# EAGLE design FluxR3-v3 (EAGLE 7.2.0)
ABBREV: Flux3; AUTHOR: Nadya B.; PROJECT: Fluxamasynth 3
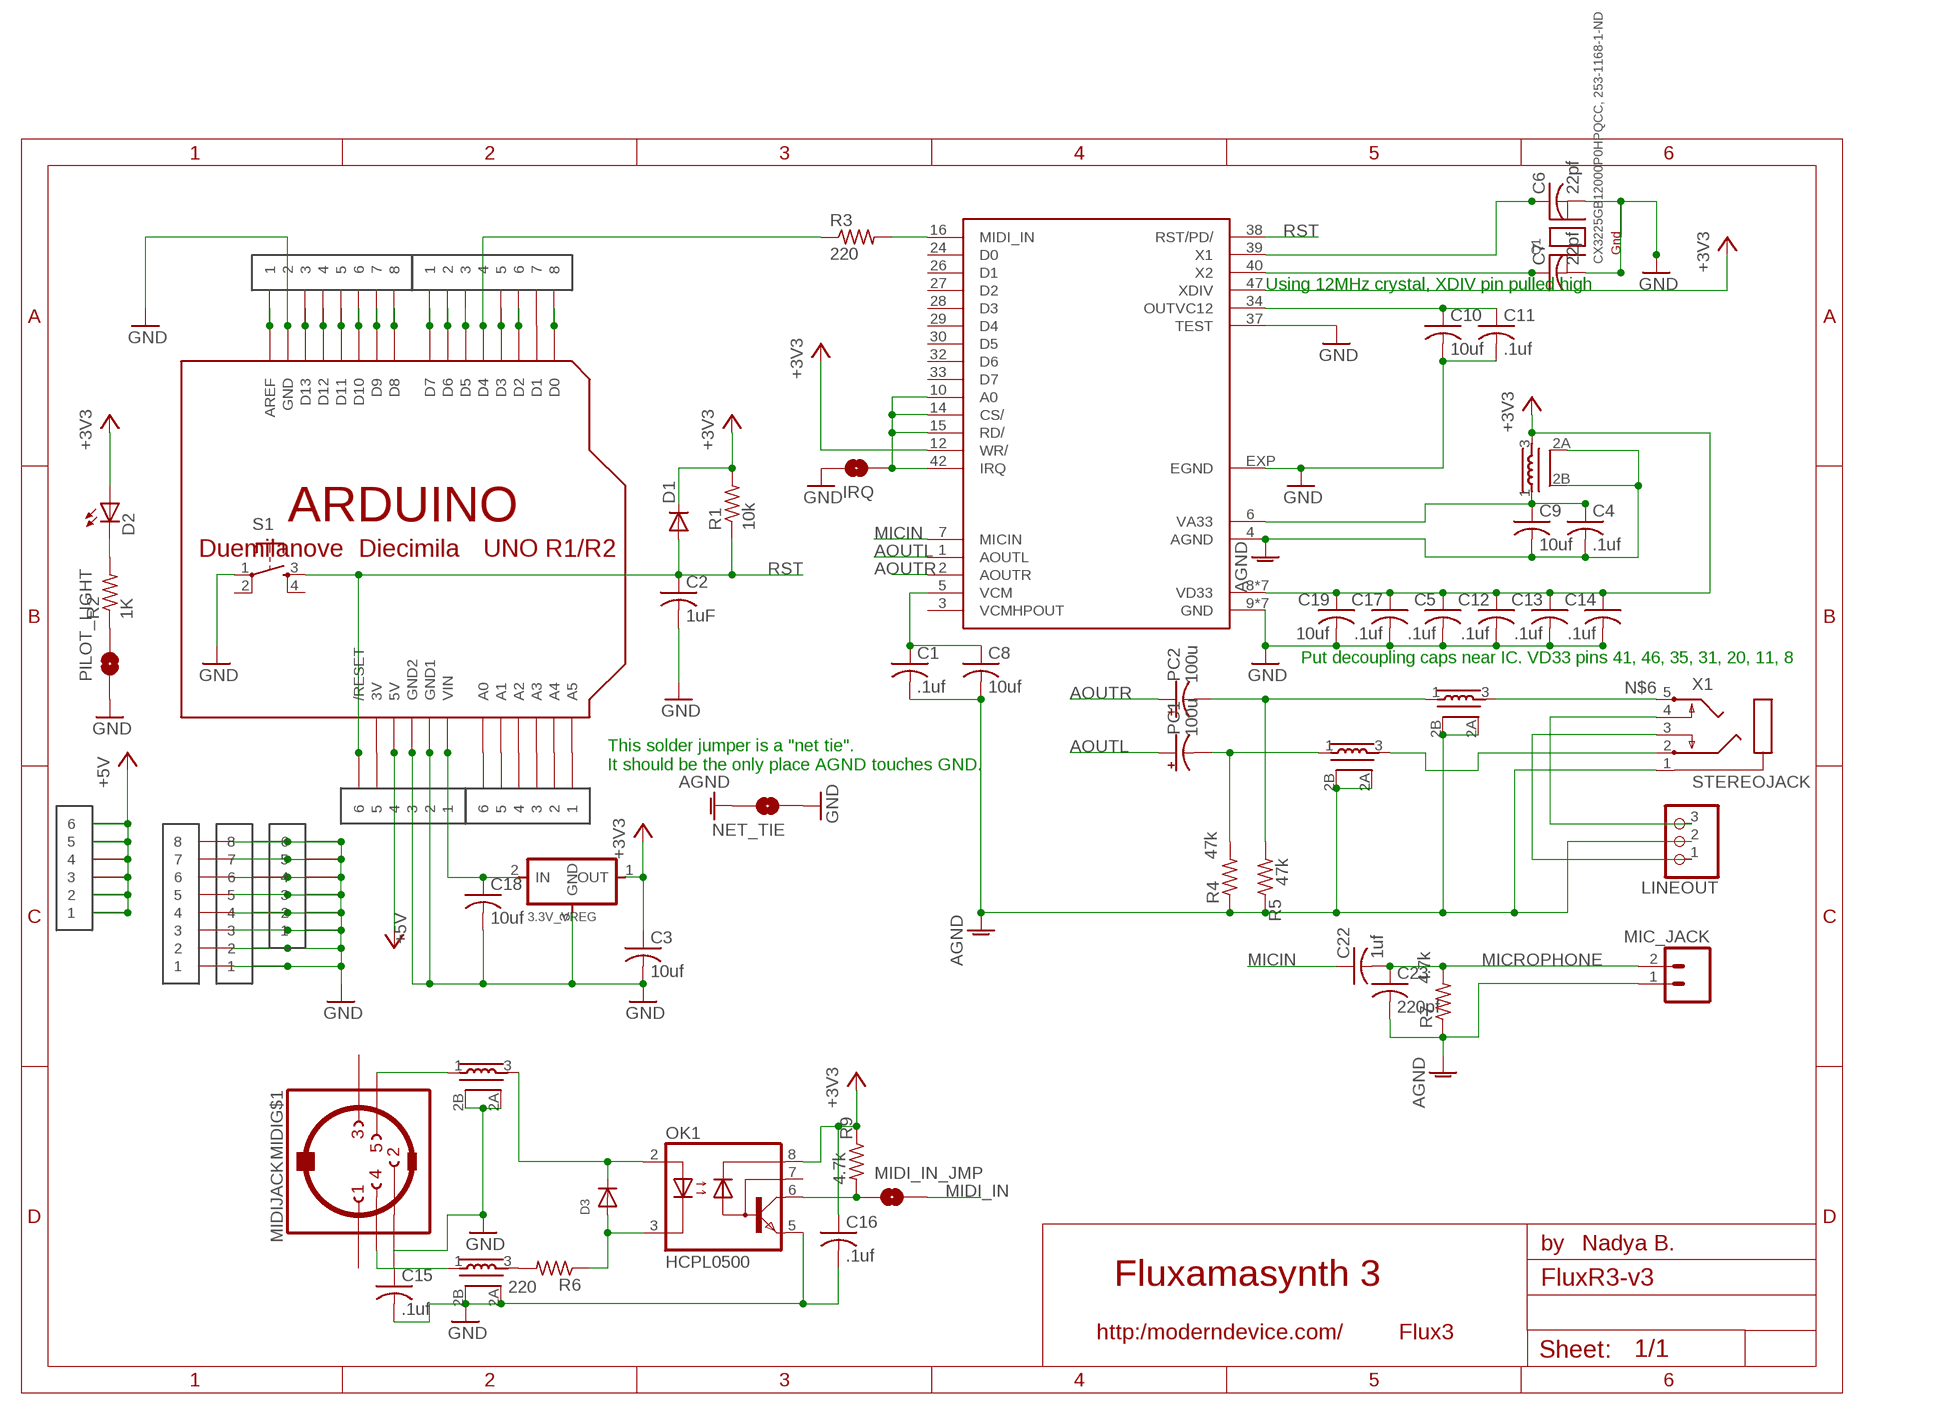
[diagram p0: schematic, sheet 1]

## Parts
3.3V_VREG  REGULATORSOT23  [SOT23]
ARDUINO  ARDUINO-NOHOLE  [ARDUINO-NOHOLE]
C1  .1uf  C-USC0603K  [C0603K]
C2  1uF  C-USC0805  [C0805]
C3  10uf  C-USC0805  [C0805]
C4  .1uf  C-USC0603K  [C0603K]
C5  .1uf  C-USC0603K  [C0603K]
C6  22pf  C-USC0805  [C0805]
C7  22pf  C-USC0805  [C0805]
C8  10uf  C-USC0805  [C0805]
C9  10uf  C-USC0805  [C0805]
C10  10uf  C-USC0805  [C0805]
C11  .1uf  C-USC0603K  [C0603K]
C12  .1uf  C-USC0603K  [C0603K]
C13  .1uf  C-USC0603K  [C0603K]
C14  .1uf  C-USC0603K  [C0603K]
C15  .1uf  C-USC0805  [C0805]
C16  .1uf  C-USC0805  [C0805]
C17  .1uf  C-USC0603K  [C0603K]
C18  10uf  C-USC0805  [C0805]
C19  10uf  C-USC0805  [C0805]
C22  1uf  C-USC0805  [C0805]
C23  220pf  C-USC0805  [C0805]
D1  DIODESOD123  [SOD123]
D2  LED1206  [LED-1206]
D3  DIODE_SOD-523  [SOD-523]
IRQ  MODERNDEVICE_SOLDERJUMPERTRACE  [MODERNDEVICE_SJ_2S-TRACE]
LINEOUT  PINHD-1X3  [1X03]
MIC_JACK  M02PTH  [1X02]
MIDI  MIDIJACK  [CP-2350]
MIDI_IN_JMP  SOLDERJUMPERNO  [SJ_2S-NO]
NET_TIE  MODERNDEVICE_SOLDERJUMPERTRACE  [MODERNDEVICE_SJ_2S-TRACE]
OK1  HCPL0500  [SOIC08]
PC1  100u  CPOL-USE  [PANASONIC_E]
PC2  100u  CPOL-USE  [PANASONIC_E]
PILOT_LIGHT  MODERNDEVICE_SOLDERJUMPERTRACE  [MODERNDEVICE_SJ_2S-TRACE]
Q1  CX3225GB12000P0HPQCC, 253-1168-1-ND  MODERNDEVICE_XTAL-4-3225  [MODERNDEVICE_NX3225]
R1  10k  R-US_M0805  [M0805]
R2  1K  R-US_M0805  [M0805]
R3  220  R-US_M0805  [M0805]
R4  47k  R-US_R0603  [R0603]
R5  47k  R-US_R0603  [R0603]
R6  220  R-US_M0805  [M0805]
R7  4.7k  R-US_M0805  [M0805]
R9  4.7k  R-US_R0603  [R0603]
S1  6MM_SWITCH6MM_SWITCH  [6MM_SWITCH]
SAM2695  SAM2695  [QFN48]
U$1  1X8_CLEAN  [1X8_CLEAN]
U$2  1X6_CLEAN  [1X6_CLEAN]
U$3  1X6_CLEAN  [1X6_CLEAN]
U$4  NFM21CC223R1H3D  [3PC]
U$5  NFM21CC223R1H3D  [3PC]
U$6  1X6_CLEAN  [1X6_CLEAN]
U$7  NFM21CC223R1H3D  [3PC]
U$8  1X6_CLEAN  [1X6_CLEAN]
U$9  1X8_CLEAN  [1X8_CLEAN]
U$10  NFM21CC223R1H3D  [3PC]
U$11  1X8_CLEAN  [1X8_CLEAN]
U$12  NFM21CC223R1H3D  [3PC]
U$13  1X8_CLEAN  [1X8_CLEAN]
X1  STEREOJACK  [STX3100]

## Nets
+3V3 [VCC]: 3.3V_VREG.1(OUT) C3.1 C5.1 C12.1 C13.1 C14.1 C16.1 C17.1 C19.1 D1.CATHODE(C) D2.A OK1.8(VCC) R1.2 R9.1 SAM2695.8(VD33) SAM2695.11(VD33) SAM2695.12(WR/) SAM2695.20(VD33) SAM2695.31(VD33) SAM2695.35(VD33) SAM2695.41(VD33) SAM2695.46(VD33) SAM2695.47(XDIV) U$7.3
+5V [VCC]: ARDUINO.5V U$2.P$1 U$2.P$2 U$2.P$3 U$2.P$4 U$2.P$5 U$2.P$6 U$6.P$4
A0: ARDUINO.A0 U$8.P$6
A1: ARDUINO.A1 U$8.P$5
A2: ARDUINO.A2 U$8.P$4
A3: ARDUINO.A3 U$8.P$3
A4: ARDUINO.A4 U$8.P$2
A5: ARDUINO.A5 U$8.P$1
AGND [GND]: C1.2 C4.2 C8.2 C9.2 C23.2 LINEOUT.2 MIC_JACK.1 NET_TIE.2 R4.1 R5.1 R7.1 SAM2695.4(AGND) U$4.2A U$4.2B U$5.2A U$5.2B U$7.2A U$7.2B X1.1
AOUTL: PC1.+ SAM2695.1(AOUTL)
AOUTR: PC2.+ SAM2695.2(AOUTR)
GND [GND]: 3.3V_VREG.3(GND) ARDUINO.GND ARDUINO.GND1 ARDUINO.GND2 C2.2 C3.2 C5.2 C6.2 C7.2 C10.2 C11.2 C12.2 C13.2 C14.2 C15.2 C16.2 C17.2 C18.2 C19.2 IRQ.2 NET_TIE.1 OK1.5(GND) PILOT_LIGHT.1 Q1.2(G2) Q1.4(G1) S1.1(P) SAM2695.9(GND) SAM2695.13(GND) SAM2695.18(GND) SAM2695.25(GND) SAM2695.36(GND) SAM2695.37(TEST) SAM2695.45(GND) SAM2695.48(GND) SAM2695.EXP(EGND) U$1.P$1 U$1.P$2 U$1.P$3 U$1.P$4 U$1.P$5 U$1.P$6 U$1.P$7 U$1.P$8 U$3.P$1 U$3.P$2 U$3.P$3 U$3.P$4 U$3.P$5 U$3.P$6 U$6.P$2 U$6.P$3 U$10.2A U$10.2B U$11.P$1 U$11.P$2 U$11.P$3 U$11.P$4 U$11.P$5 U$11.P$6 U$11.P$7 U$11.P$8 U$12.2A U$12.2B U$13.P$2
MICIN: C22.1 SAM2695.7(MICIN)
MICROPHONE: C22.2 C23.1 MIC_JACK.2 R7.2
MIDI_FROM_ARDUINO: ARDUINO.D4 MIDI_IN_JMP.1 OK1.6(VO) R3.1 R9.2 U$9.P$4
MIDI_IN: MIDI_IN_JMP.2 R3.2 SAM2695.16(MIDI_IN)
N$1: ARDUINO.D1 U$9.P$7
N$2: MIDI.4 U$10.1
N$3 [GND]: IRQ.1 SAM2695.10(A0) SAM2695.14(CS/) SAM2695.15(RD/) SAM2695.42(IRQ)
N$4: ARDUINO.3V U$6.P$5
N$5: PC1.- R4.2 U$5.1
N$6: U$4.3 X1.5
N$7: R6.2 U$10.3
N$8: D3.K(C) OK1.2(A) U$12.3
N$9: D2.C R2.2
N$10: C15.1 MIDI.2
N$11: MIDI.5 U$12.1
N$13: D3.A OK1.3(C) R6.1
N$15: ARDUINO.D8 U$13.P$8
N$19: ARDUINO.D9 U$13.P$7
N$21: LINEOUT.3 X1.4
N$22: ARDUINO.D11 U$13.P$5
N$23: ARDUINO.D10 U$13.P$6
N$24: LINEOUT.1 X1.3
N$25: ARDUINO.D12 U$13.P$4
N$26: ARDUINO.D13 U$13.P$3
N$27: ARDUINO.D6 U$9.P$2
N$28: ARDUINO.AREF U$13.P$1
N$29: ARDUINO.D5 U$9.P$3
N$30: ARDUINO.D0 U$9.P$8
N$31: ARDUINO.D2 U$9.P$6
N$32: ARDUINO.D3 U$9.P$5
N$35: ARDUINO.D7 U$9.P$1
N$47: PILOT_LIGHT.2 R2.1
N$48: C6.1 SAM2695.39(X1)
N$49: C7.1 SAM2695.40(X2)
OUT_L: U$5.3 X1.2
OUT_R: PC2.- R5.2 U$4.1
OUTVC12: C10.1 C11.1 SAM2695.34(OUTVC12)
RST: ARDUINO.RESET(/RESET) C2.1 D1.ANODE(A) R1.1 S1.3(S) SAM2695.38(RST/PD/) U$6.P$6
VA33 [VCC]: C4.1 C9.1 SAM2695.6(VA33) U$7.1
VCM: C1.1 C8.1 SAM2695.5(VCM)
VIN [VCC]: 3.3V_VREG.2(IN) ARDUINO.VIN C18.1 U$6.P$1
Unconnected: MIDI.1 MIDI.3 MIDI.PE1(MT) MIDI.PE2(MT) MIDI.PE(MT) MIDI.PE@(MT) OK1.7(VB) Q1.1(X1) Q1.3(X2) S1.2(P1) S1.4(S1) SAM2695.3(VCMHPOUT) SAM2695.24(D0) SAM2695.26(D1) SAM2695.27(D2) SAM2695.28(D3) SAM2695.29(D4) SAM2695.30(D5) SAM2695.32(D6) SAM2695.33(D7)

## Notes on the sheet
- Using 12MHz crystal, XDIV pin pulled high
- Put decoupling caps near IC. VD33 pins 41, 46, 35, 31, 20, 11, 8
- This solder jumper is a "net tie".
  It should be the only place AGND touches GND.

## Library data of the parts
3.3V_VREG = ng:REGULATOR
ARDUINO = ModernDevice:ARDUINO: Arduino Diecimila/Duemilanove Make a shield with ease, this package has all the named pins as well as the two mounting drill holes and an outline of the USB and DC power connector. The outline is on the DIMENSION layer, so if your board house uses it they will cut the outline to match. http://www.ladyada.net/library/pcb/eaglelibrary.html
C1-C19 C22 C23 = rcl:C-US: CAPACITOR, American symbol
D1 = ng:DIODE: DIODE high speed (Philips)
D2 = ModernDevice:LED: LEDs Standard schematic elements and footprints for 5mm, 3mm, 1206, and 0603 sized LEDs. 5mm - Spark Fun Electronics SKU : COM-00529 (and others)
D3 = ModernDevice:DIODE: Diode SMADIODE - SMA Surface Mount Package 20V 1A Schottky Diode Digikey: 641-1014-6-ND DO-1N4148 - Through Hole Small Current Diode SOD-123 20V 1 A (.5mV Vf) Schottky Diode - Digikey: MBRX120TPMSCT-ND 4148 diode 75V 1N4148WTPMSCT-ND 1N4148W-TP - Micro Commercial Co 1N4148WTPMSCT-ND This part is RoHS compliant. SOD-323 10V 570mA (.38mV Vf, 3ns) Schottky Diode - Digikey: ZLLS410CT-ND SOD-523 30V 30mA Schottky Diode (RB751S-40TE61) - Digikey: RB751S-40TE61CT-ND 75V 150mA 4148 type - Digikey: 1N4148XTPMSCT-ND SOT23-R/W - SOT23 Package (R = Solder Paste/Reflow Ovens, W = Hand-Soldering) BAT54Film 40V 300mA - Digikey: 497-7162-1-ND DO-214AC DO-214AC 400V 1A Fast Recovery - Digikey: RS1GFSCT-ND MELF-34 4148 style diode - Digikey:FDLL4148CT-ND
IRQ NET_TIE PILOT_LIGHT = BBLeo_v2:MODERNDEVICE_SOLDERJUMPER: Solder Jumper Standard SMD solder jumper. Used to automate production. Two varients : Normally Open and Normally Closed are the same, but have different paste layers. NC will have a large amount of paste and should jumper during reflow.
LINEOUT = pinhead:PINHD-1X3: PIN HEADER
MIC_JACK = ModernDevice:M02: Header 2 Standard 2-pin 0.1" header. Use with straight break away headers (SKU : PRT-00116), right angle break away headers (PRT-00553), swiss pins (PRT-00743), machine pins (PRT-00117), and female headers (PRT-00115). Molex polarized connector foot print use with SKU : PRT-08233 with associated crimp pins and housings.
MIDI = ModernDevice:MIDIJACK: DIN 5 jack also known as MIDI jack A modification of conn-hirshman:MAB5SH with two options for the grounding 'teeth'
MIDI_IN_JMP = ModernDevice:SOLDERJUMPER: Solder Jumper Standard SMD solder jumper. Used to automate production. Two varients : Normally Open and Normally Closed are the same, but have different paste layers. NC will have a large amount of paste and should jumper during reflow.
OK1 = optocoupler:HCPL0500: HEWLETT PACKARD OPTO COUPLER; MF: AGILENT TECHNOLOGIES; MPN: HCPL-0500-000E; OC_FARNELL: 9995226; OC_NEWARK: 31K6926
PC1 PC2 = ModernDevice:CPOL-US: POLARIZED CAPACITOR, American symbol
Q1 = BBLeo_v2:MODERNDEVICE_XTAL-4: Classic 4-pin 3.2 x 2.5mm crystal
R1-R7 R9 = rcl:R-US_: RESISTOR, American symbol
S1 = ng:6MM_SWITCH: OMRON SWITCH
SAM2695 = ModernDevice:SAM2695
U$1 U$9 U$11 U$13 = ModernDevice:1X8_CLEAN
U$2 U$3 U$6 U$8 = ModernDevice:1X6_CLEAN
U$4 U$5 U$7 U$10 U$12 = nadya_library:NFM21CC223R1H3D: CAPACITOR-TYPE NOISE SUPPRESSION FILTER digikey #NFM21CC223R1H3D
X1 = adafruit:STEREOJACK: MIC/HEADPHONE JACK Stereo jack with two switches. Kycon STX3100, CUI SJ1-3555NG and/or 4UCon 05544

## Net classes
0 default: width 0.2 mm, drill 0.25 mm, clearance 0.2 mm
1 GND: width 0.2 mm, drill 0.25 mm, clearance 0.2 mm
2 VCC: width 0.2 mm, drill 0.25 mm, clearance 0.2 mm
3 VBUS: width 0.2 mm, drill 0.25 mm, clearance 0.25 mm

## Board
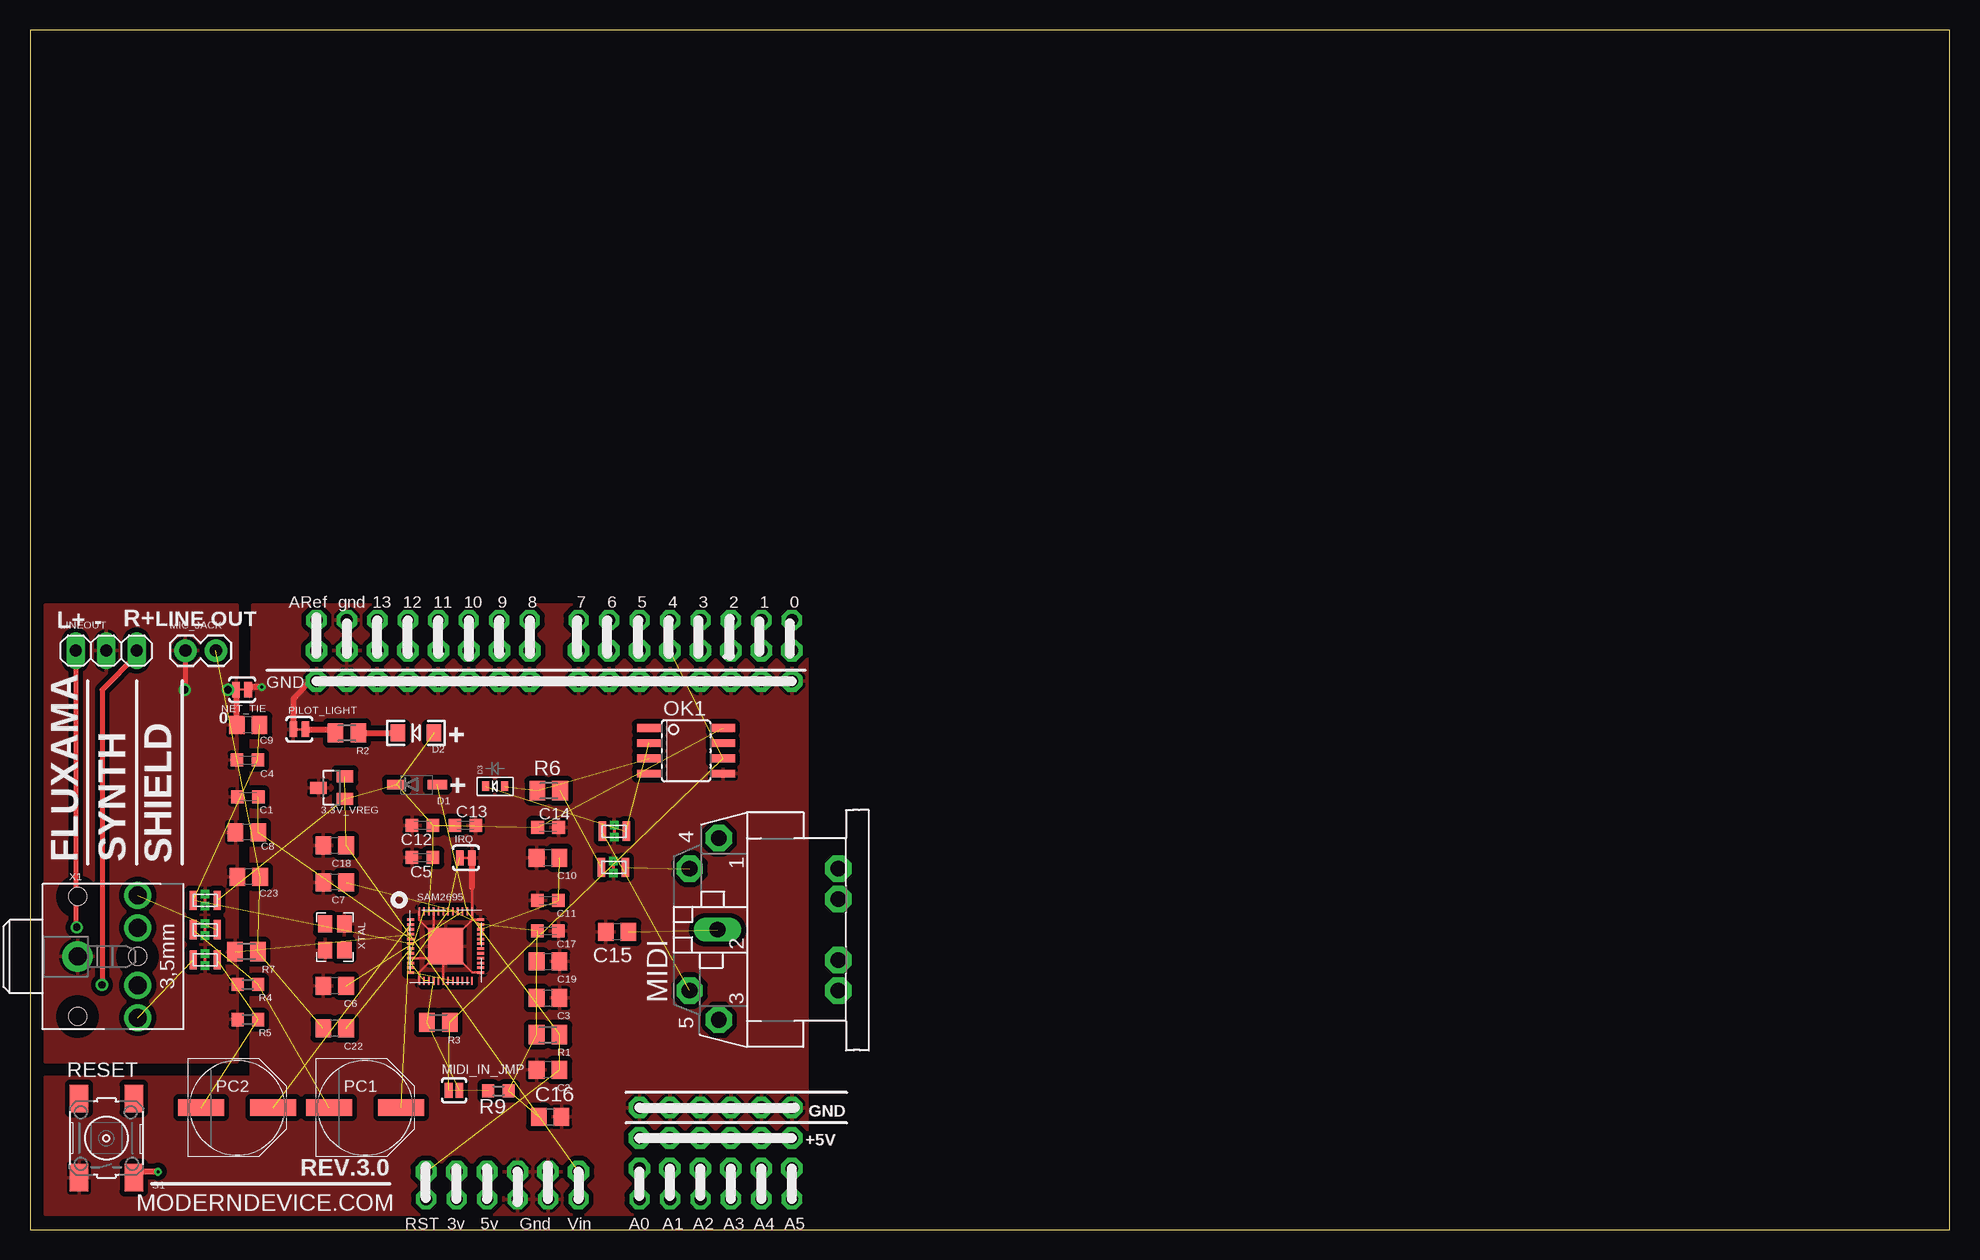
[diagram p1: board, top side]
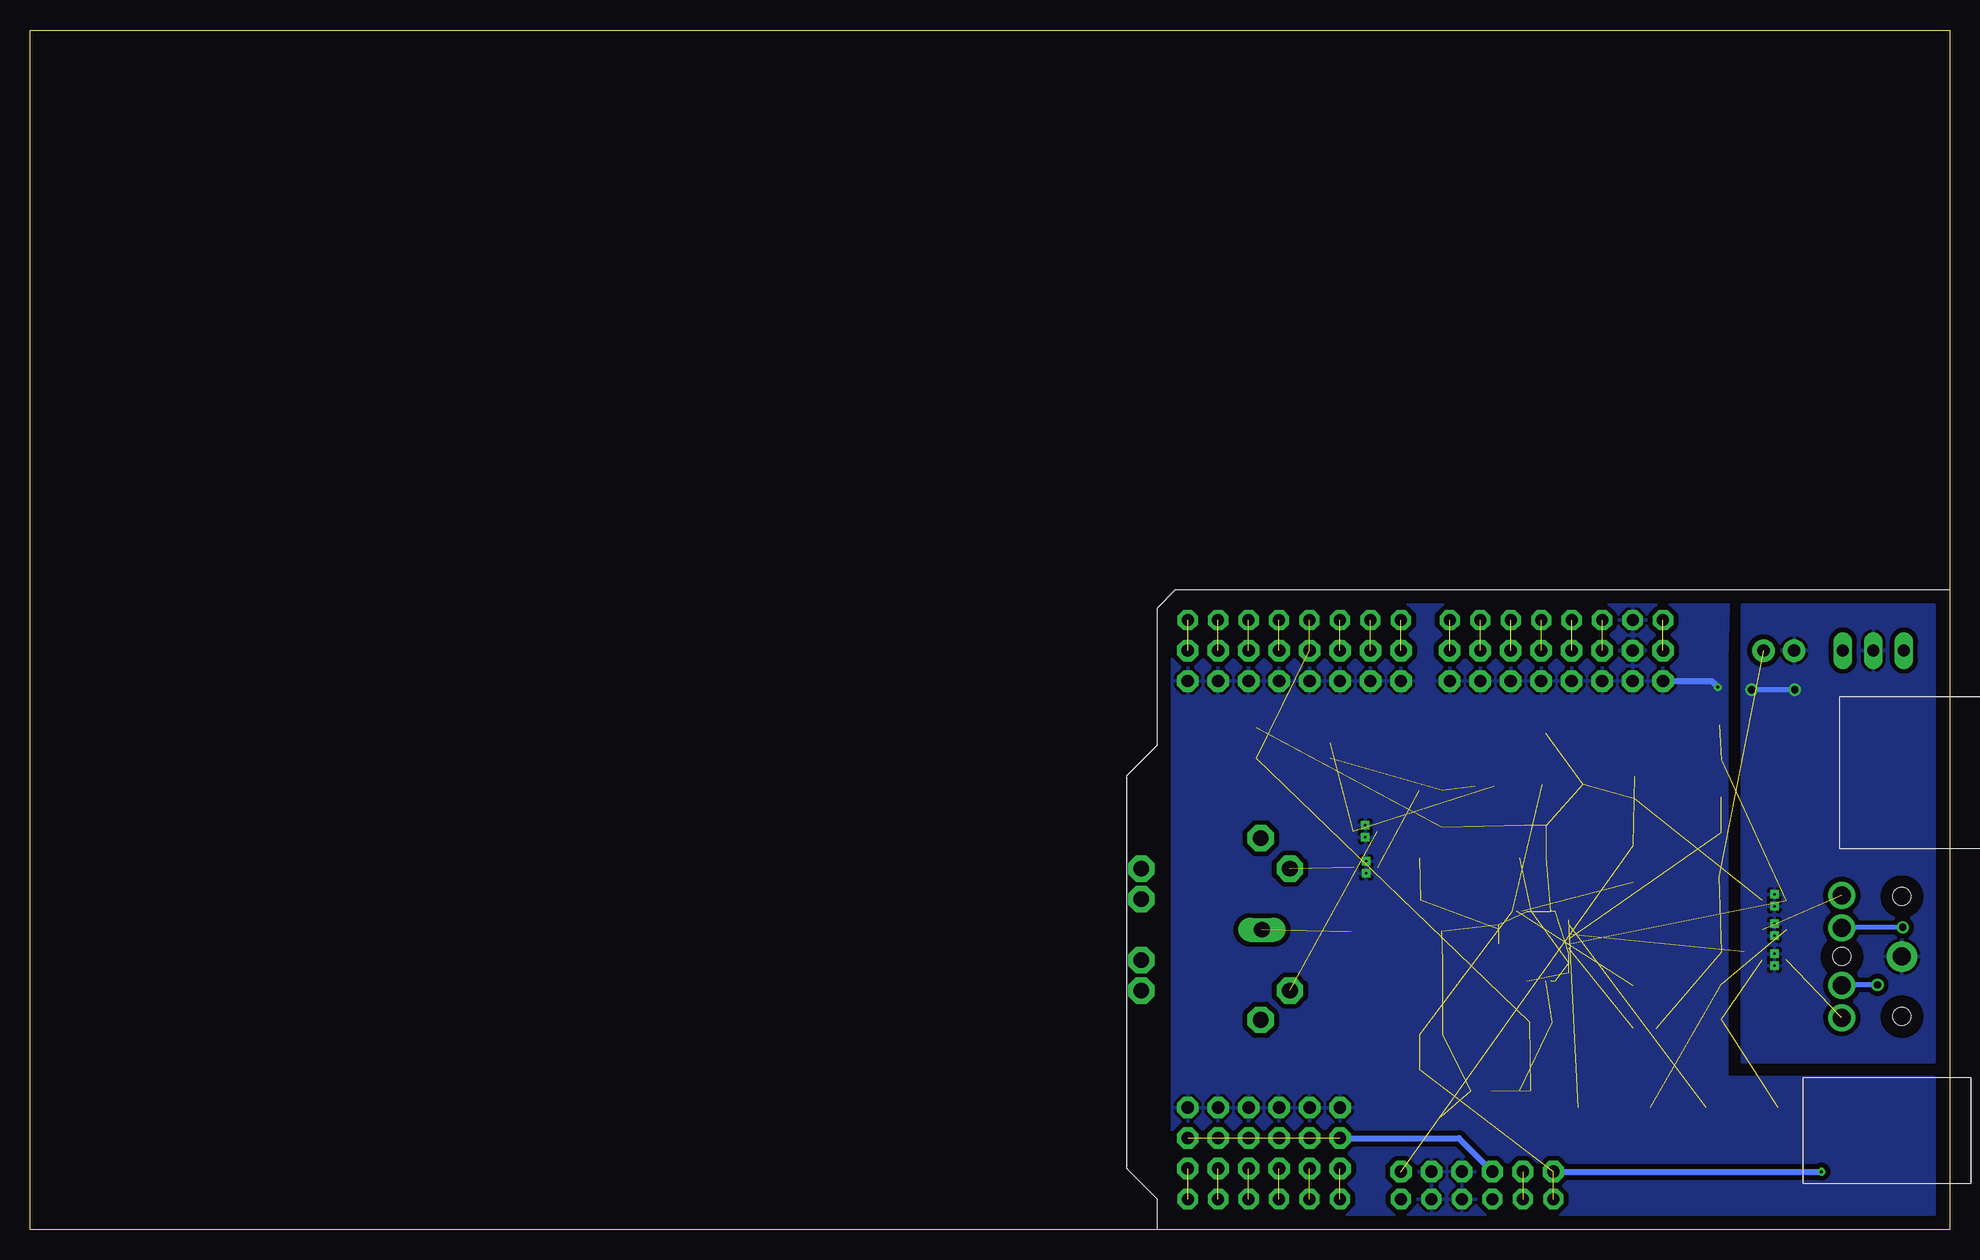
[diagram p2: board, bottom side, seen from below]

Size 160 x 100 mm. Coordinates in mm from the lower left corner, seen from the top.
Outline: 0,0 160,0 160,100 0,100 0,0
Copper layers (1*16): Top 0.035mm / dielectric 1.5mm / Bottom 0.035mm
Design rules "default *": minimum track width 0.2mm, minimum drill 0.25mm, track to track 8mil, track to pad 6mil, pad to pad 6mil, via to via 8mil, smd to smd 6mil, copper to edge 40mil, drill to drill 8mil, minimum pad ring 10mil, minimum via ring 8mil, stop-mask expansion 4mil, vias tented up to drill 0mil, thermal gap 10mil

### Footprints (pad centres in the part's own frame; a part is rotated, then mirrored left to right if it is on the bottom)
SOT23 = smd 1 x 1.4: 1 -0.95,-1.1; 2 0.95,-1.1; 3 0,1.1
ARDUINO-NOHOLE = drill 1 pad 1.676 octagon: 3V 35.56,2.54; 5V 38.1,2.54; A0 50.8,2.54; A1 53.34,2.54; A2 55.88,2.54; A3 58.42,2.54; A4 60.96,2.54; A5 63.5,2.54; AREF 23.876,50.8; D0 63.5,50.8; D1 60.96,50.8; D2 58.42,50.8; D3 55.88,50.8; D4 53.34,50.8; D5 50.8,50.8; D6 48.26,50.8; D7 45.72,50.8; D8 41.656,50.8; D9 39.116,50.8; D10 36.576,50.8; D11 34.036,50.8; D12 31.496,50.8; D13 28.956,50.8; GND 26.416,50.8; GND1 43.18,2.54; GND2 40.64,2.54; RESET 33.02,2.54; VIN 45.72,2.54
C0603K = smd 1.05 x 1.08: 1 -0.875,0; 2 0.875,0
C0805 = smd 1.3 x 1.5: 1 -0.95,0; 2 0.95,0
SOD123 = smd 1.6 x 0.8: ANODE 1.7,0; CATHODE -1.7,0
LED-1206 = smd 1.2 x 1.4: A -1.5,0; C 1.5,0
SOD-523 = smd 0.8 x 0.6: A 0,-0.8; K 0,0.8
MODERNDEVICE_SJ_2S-TRACE = smd 0.635 x 1.27: 1 -0.508,0; 2 0.508,0
1X03 = drill 1.016 long: 1 -2.54,0; 2 0,0; 3 2.54,0
1X02 = drill 1.016 pad 1.88: 1 0,0; 2 2.54,0
CP-2350 = drill 1.321 pad 2.184 octagon: 1 7.62,12.58; 3 -7.52,12.58; 4 5.08,15.02; 5 -5.08,15.02; PE -2.54,2.62; PE1 -5.08,2.62; PE2 5.08,2.62; PE@ 2.54,2.62 | drill 1.321 long: 2 0,12.68
SJ_2S-NO = smd 0.635 x 1.27: 1 -0.45,0; 2 0.45,0
SOIC08 = smd 0.66 x 2.032: 1 -1.905,-3.073; 2 -0.635,-3.073; 3 0.635,-3.073; 4 1.905,-3.073; 5 1.905,3.073; 6 0.635,3.073; 7 -0.635,3.073; 8 -1.905,3.073
PANASONIC_E = smd 3.8 x 1.4: + 3,0; - -3,0
MODERNDEVICE_NX3225 = smd 1.4 x 1.2: 1 -1.1,-0.8; 2 1.1,-0.8; 3 1.1,0.8; 4 -1.1,0.8
M0805 = smd 1.3 x 1.6: 1 -0.95,0; 2 0.95,0
R0603 = smd 1 x 1.1: 1 -0.85,0; 2 0.85,0
6MM_SWITCH = smd 2.286 x 1.524: 1 -3.302,2.286; 2 3.302,2.286; 3 -3.302,-2.286; 4 3.302,-2.286
QFN48 = smd 0.65 x 0.2: 1 -2.9,2.3; 2 -2.9,1.9; 3 -2.9,1.5; 4 -2.9,1.1; 5 -2.9,0.7; 6 -2.9,0.3; 7 -2.9,-0.1; 8 -2.9,-0.5; 9 -2.9,-0.9; 10 -2.9,-1.3; 11 -2.9,-1.7; 12 -2.9,-2.1; 25 2.9,-2.1; 26 2.9,-1.7; 27 2.9,-1.3; 28 2.9,-0.9; 29 2.9,-0.5; 30 2.9,-0.1; 31 2.9,0.3; 32 2.9,0.7; 33 2.9,1.1; 34 2.9,1.5; 35 2.9,1.9; 36 2.9,2.3 | smd 0.2 x 0.65: 13 -2.2,-2.8; 14 -1.8,-2.8; 15 -1.4,-2.8; 16 -1,-2.8; 17 -0.6,-2.8; 18 -0.2,-2.8; 19 0.2,-2.8; 20 0.6,-2.8; 21 1,-2.8; 22 1.4,-2.8; 23 1.8,-2.8; 24 2.2,-2.8; 37 2.2,3; 38 1.8,3; 39 1.4,3; 40 1,3; 41 0.6,3; 42 0.2,3; 43 -0.2,3; 44 -0.6,3; 45 -1,3; 46 -1.4,3; 47 -1.8,3; 48 -2.2,3 | smd 3 x 3: EXP 0,0.1
1X8_CLEAN = drill 1.016 pad 1.778 octagon: P$1 -8.89,0; P$2 -6.35,0; P$3 -3.81,0; P$4 -1.27,0; P$5 1.27,0; P$6 3.81,0; P$7 6.35,0; P$8 8.89,0
1X6_CLEAN = drill 1.016 pad 1.778 octagon: P$1 -6.35,0; P$2 -3.81,0; P$3 -1.27,0; P$4 1.27,0; P$5 3.81,0; P$6 6.35,0
3PC = smd 0.6 x 1.6: 1 0.3,0.8; 3 2.3,0.8 | drill 0.2 pad 0.6 square: 2A 1.3,1.3; 2B 1.3,0.3
STX3100 = drill 1.5 pad 2.54: 1 2.7,-0.1 | drill 1.5: 2 7.7,5; 3 7.7,2.3; 4 7.7,-2.5; 5 7.7,-5.2 | hole 1.5: 2.7,4.9; 2.7,-5.1; 7.7,-0.1

### Placement (x,y rotation side)
3.3V_VREG  25.15,36.83 90 top
ARDUINO  0,0 0 top
C1  18.16,36.07 180 top
C2  43.18,13.3 180 top
C3  43.18,19.3 0 top
C4  18.11,39.14 180 top
C5  32.71,31.01 180 top
C6  25.4,20.32 180 top
C7  25.4,28.96 180 top
C8  18.08,33.12 180 top
C9  18.19,42.06 180 top
C10  43.18,30.99 180 top
C11  43.18,27.43 180 top
C12  32.71,33.7 180 top
C13  36.28,33.7 0 top
C14  43.19,33.52 0 top
C15  48.94,24.8 180 top
C16  43.35,9.39 0 top
C17  43.18,24.89 0 top
C18  25.4,32 180 top
C19  43.18,22.35 0 top
C22  25.4,16.76 180 top
C23  18.24,29.41 180 top
D1  32.26,37.08 0 top
D2  32.18,41.4 180 top
D3  38.77,36.95 90 top
IRQ  36.33,30.99 0 top
LINEOUT  6.35,48.26 0 top
MIC_JACK  12.95,48.26 0 top
MIDI  70,25 90 top
MIDI_IN_JMP  35.34,11.6 0 top
NET_TIE  17.68,45.01 180 top
OK1  54.68,39.91 270 top
PC1  27.94,10.16 0 top
PC2  17.27,10.16 0 top
PILOT_LIGHT  22.45,41.71 0 top
Q1  25.4,24.38 270 top
R1  43.18,16.26 180 top
R2  26.42,41.4 0 top
R3  34.04,17.27 180 top
R4  18.16,20.43 0 top
R5  18.16,17.5 0 top
R6  43.23,36.59 0 top
R7  18.03,23.16 0 top
R9  39.05,11.55 180 top
S1  6.37,7.62 90 top
SAM2695  34.65,23.52 0 top
U$1  54.61,45.72 0 top
U$2  57.15,7.62 0 top
U$3  57.15,10.16 0 top
U$4  15.9,23.28 180 top
U$5  13.29,24.19 0 top
U$6  39.37,4.83 180 top
U$7  13.29,26.64 0 top
U$8  57.15,5.08 180 top
U$9  54.61,48.26 0 top
U$10  49.93,31 180 top
U$11  32.77,45.72 0 top
U$12  47.41,32.4 0 top
U$13  32.77,48.26 0 top
X1  1.27,22.86 0 top

### Tracks (layer width: path | path; a pad name or v marks a point on that pad's centre or on a via)
+3V3  (23 unrouted)
+5V  (5 unrouted)
  Top 0.508: ARDUINO.5V U$6.P$4
  Bottom 0.508: U$2.P$1 40.89,7.62 U$6.P$4
A0  (1 unrouted)
A1  (1 unrouted)
A2  (1 unrouted)
A3  (1 unrouted)
A4  (1 unrouted)
A5  (1 unrouted)
AGND  (via drill 0.6)  (1 unrouted)
  Top 0.406: MIC_JACK.1 12.95,45.05 v12.9,45 | v16.5,45 NET_TIE.2
  Top 0.508: NET_TIE.2 17.17,42.13 C9.2
  Bottom 0.406: v12.9,45 v16.5,45
  pour Bottom (isolate 0.406): 1.27,52.07 17.27,52.07 17.27,13.97 1.27,13.97
  pour Top (isolate 0.406): 1.27,52.07 17.27,52.07 17.27,13.97 1.27,13.97
AOUTL  (1 unrouted)
AOUTR  (1 unrouted)
GND  (via drill 0.25)
  Top 0.2: SAM2695.36 36.85,25.82 | 36.85,25.82 SAM2695.EXP | SAM2695.45 33.65,24.62 | 33.65,24.62 SAM2695.EXP | 36.85,25.82 SAM2695.37 36.85,28.55 | 33.65,24.62 33.65,23.02 | 33.65,23.02 34.45,22.23 | SAM2695.18 34.45,22.64 35.04,23.23 | 33.65,23.02 33.64,23.02 33.25,22.63 33.25,22.62 SAM2695.9 | SAM2695.9 | SAM2695.48 32.45,25.82 SAM2695.EXP | SAM2695.13 32.45,21.42 SAM2695.EXP | SAM2695.25 36.85,21.42 35.04,23.23 | 35.04,23.23 SAM2695.EXP
  Top 0.508: U$11.P$1 23.37,45.72 21.94,44.18 21.94,41.79 PILOT_LIGHT.1 | v19.3,45.21 18.39,45.21 NET_TIE.1 | 36.85,28.55 IRQ.2
  Bottom 0.508: U$11.P$1 19.81,45.72 v19.3,45.21
  pour Bottom (isolate 0.406): 18.54,52.07 18.44,52.12 18.54,47.45 18.54,12.7 1.27,12.7 1.27,1.27 64.77,1.27 64.77,52.07
  pour Top (isolate 0.406): 18.54,52.07 18.44,44.45 18.44,44.45 18.44,12.7 1.27,12.7 1.27,1.27 64.77,1.27 64.77,52.07
MICIN  (1 unrouted)
MICROPHONE  (3 unrouted)
MIDI_FROM_ARDUINO  (5 unrouted)
MIDI_IN  (2 unrouted)
N$1  (1 unrouted)
N$2  (1 unrouted)
N$3  (4 unrouted)
N$4  (1 unrouted)
N$5  (2 unrouted)
N$6  (1 unrouted)
N$7  (1 unrouted)
N$8  (2 unrouted)
N$9
  Top 0.508: R2.2 D2.C
N$10  (1 unrouted)
N$11  (1 unrouted)
N$13  (2 unrouted)
N$15  (1 unrouted)
N$19  (1 unrouted)
N$21  (via drill 0.6)
  Top 0.406: LINEOUT.3 8.89,47.89 6,45 v6,20.4
  Bottom 0.406: v6,20.4 8.93,20.4 X1.4
N$22  (1 unrouted)
N$23  (1 unrouted)
N$24  (via drill 0.6 pad 1.02)
  Top 0.406: LINEOUT.1 3.81,25.29 v3.9,25.2
  Bottom 0.406: v3.9,25.2 8.93,25.2 X1.3
N$25  (1 unrouted)
N$26  (1 unrouted)
N$27  (1 unrouted)
N$28  (1 unrouted)
N$29  (1 unrouted)
N$30  (1 unrouted)
N$31  (1 unrouted)
N$32  (1 unrouted)
N$35  (1 unrouted)
N$47
  Top 0.508: PILOT_LIGHT.2 25.16,41.71 R2.1
N$48  (1 unrouted)
N$49  (1 unrouted)
OUT_L  (1 unrouted)
OUT_R  (2 unrouted)
OUTVC12  (2 unrouted)
RST  (via drill 0.25 pad 0.61)  (5 unrouted)
  Top 0.508: v10.67,4.83 9.16,4.83 S1.3
  Bottom 0.508: U$6.P$6 v10.67,4.83
VA33  (3 unrouted)
VCM  (2 unrouted)
VIN  (2 unrouted)
  Top 0.508: ARDUINO.VIN U$6.P$1

### Text on the board
tPlace: L+ | - | R+ | LINE OUT | GND | 0 | + | + | FLUXAMA | SYNTH | SHIELD | RESET | GND | +5V | REV.3.0 | MODERNDEVICE.COM
_tsilk: XTAL